# EAGLE design pi_sainsmart_relay (EAGLE 6.4)
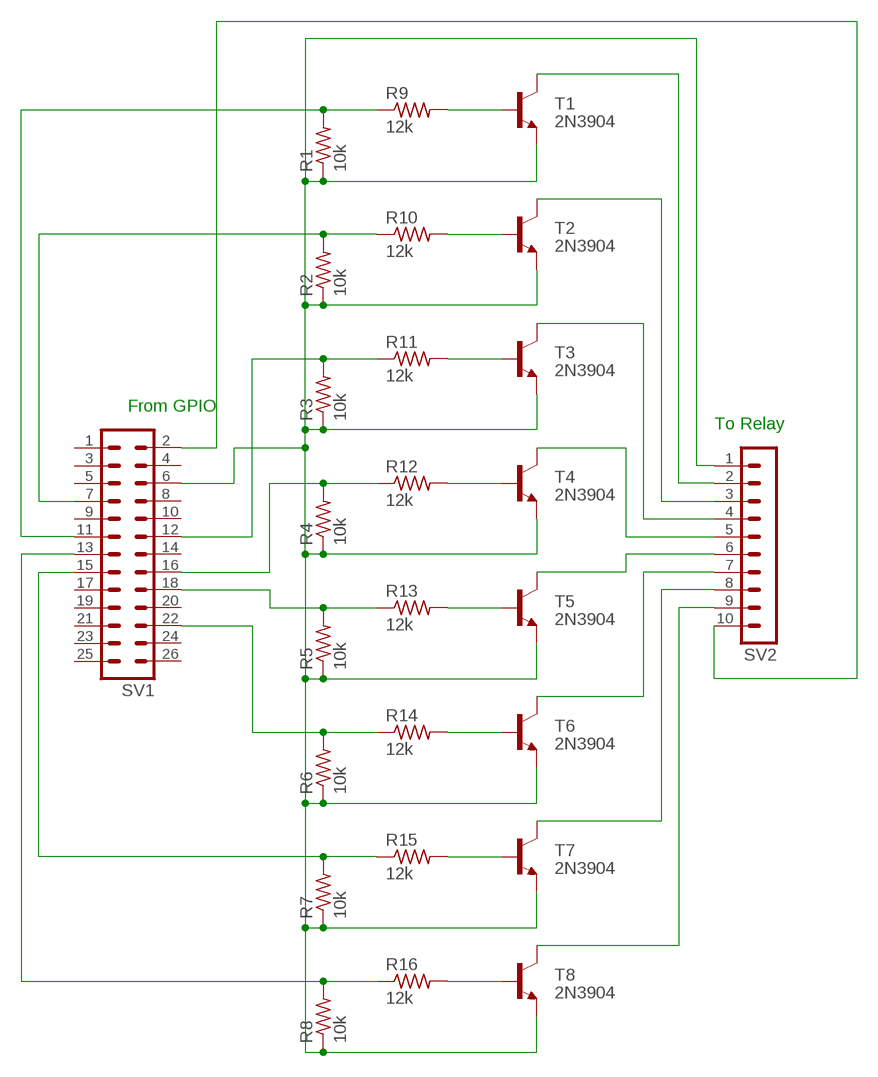
[diagram p0: schematic, sheet 1]

## Parts
R1  10k  R-US_0204/2V  [0204V]
R2  10k  R-US_0204/2V  [0204V]
R3  10k  R-US_0204/2V  [0204V]
R4  10k  R-US_0204/2V  [0204V]
R5  10k  R-US_0204/2V  [0204V]
R6  10k  R-US_0204/2V  [0204V]
R7  10k  R-US_0204/2V  [0204V]
R8  10k  R-US_0204/2V  [0204V]
R9  12k  R-US_0207/12  [0207/12]
R10  12k  R-US_0207/12  [0207/12]
R11  12k  R-US_0207/12  [0207/12]
R12  12k  R-US_0207/12  [0207/12]
R13  12k  R-US_0207/12  [0207/12]
R14  12k  R-US_0207/12  [0207/12]
R15  12k  R-US_0207/12  [0207/12]
R16  12k  R-US_0207/12  [0207/12]
SV1  MA13-2  [MA13-2]
SV2  MA10-1  [MA10-1]
T1  2N3904  -NPN-TO92-EBC  [TO92-EBC]
T2  2N3904  -NPN-TO92-EBC  [TO92-EBC]
T3  2N3904  -NPN-TO92-EBC  [TO92-EBC]
T4  2N3904  -NPN-TO92-EBC  [TO92-EBC]
T5  2N3904  -NPN-TO92-EBC  [TO92-EBC]
T6  2N3904  -NPN-TO92-EBC  [TO92-EBC]
T7  2N3904  -NPN-TO92-EBC  [TO92-EBC]
T8  2N3904  -NPN-TO92-EBC  [TO92-EBC]

## Nets
AAA: R8.2 R16.1 SV1.13
BBB: R1.2 R9.1 SV1.11
FIVEV: SV1.2 SV2.10
GND: R1.1 R2.1 R3.1 R4.1 R5.1 R6.1 R7.1 R8.1 SV1.6 SV2.1 T1.E T2.E T3.E T4.E T5.E T6.E T7.E T8.E
N$1: R16.2 T8.B
N$2: R15.2 T7.B
N$3: R14.2 T6.B
N$4: R13.2 T5.B
N$5: R12.2 T4.B
N$6: R11.2 T3.B
N$7: R10.2 T2.B
N$8: R9.2 T1.B
N$12: SV2.3 T2.C
N$13: SV2.4 T3.C
N$14: SV2.5 T4.C
N$15: SV2.6 T5.C
N$16: SV2.7 T6.C
N$17: SV2.8 T7.C
N$18: SV2.2 T1.C
N$19: SV2.9 T8.C
N$20: R3.2 R11.1 SV1.12
N$21: R4.2 R12.1 SV1.16
N$22: R5.2 R13.1 SV1.18
N$23: R6.2 R14.1 SV1.22
N$24: R2.2 R10.1 SV1.7
N$27: R7.2 R15.1 SV1.15
Unconnected: SV1.1 SV1.3 SV1.4 SV1.5 SV1.8 SV1.9 SV1.10 SV1.14 SV1.17 SV1.19 SV1.20 SV1.21 SV1.23 SV1.24 SV1.25 SV1.26

## Notes on the sheet
- From GPIO
- To Relay

## Library data of the parts
R1-R16 = resistor:R-US_: RESISTOR, American symbol
SV1 = con-lstb:MA13-2: PIN HEADER; OC_FARNELL: unknown; OC_NEWARK: unknown
SV2 = con-lstb:MA10-1: PIN HEADER; OC_FARNELL: unknown; OC_NEWARK: unknown
T1-T8 = transistor:*-NPN-: NPN Transistror BF959 corrected 2008.03.06

## Board
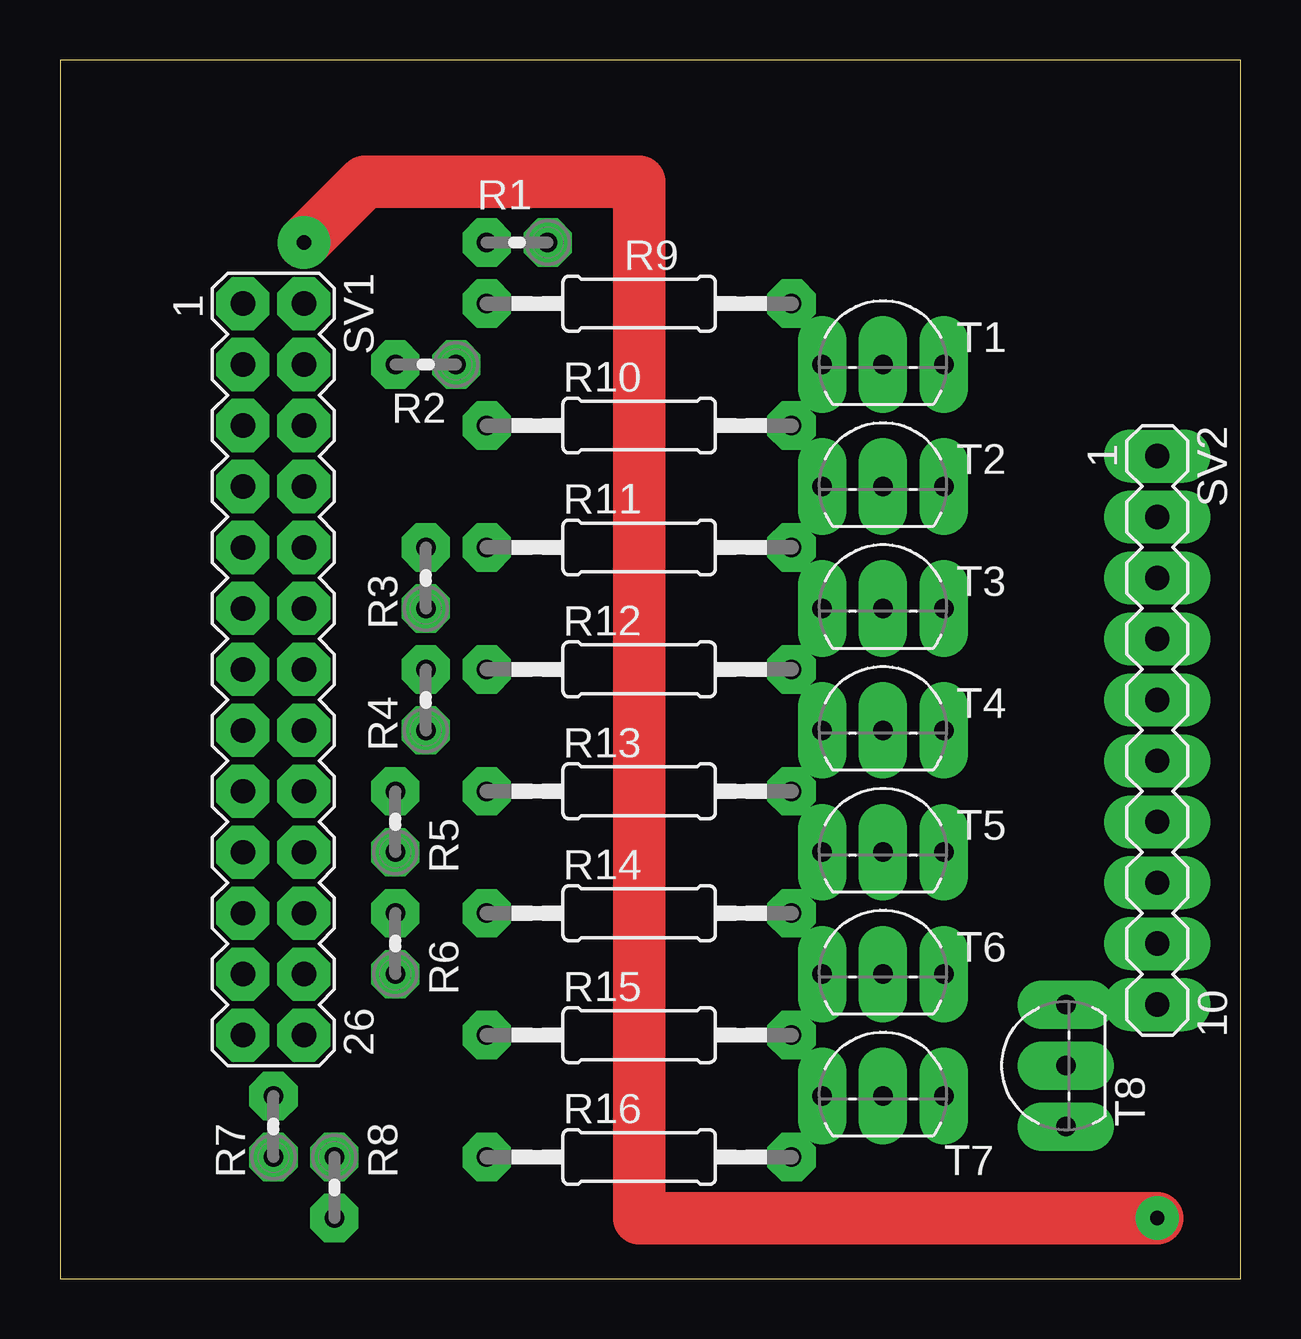
[diagram p1: board, top side]
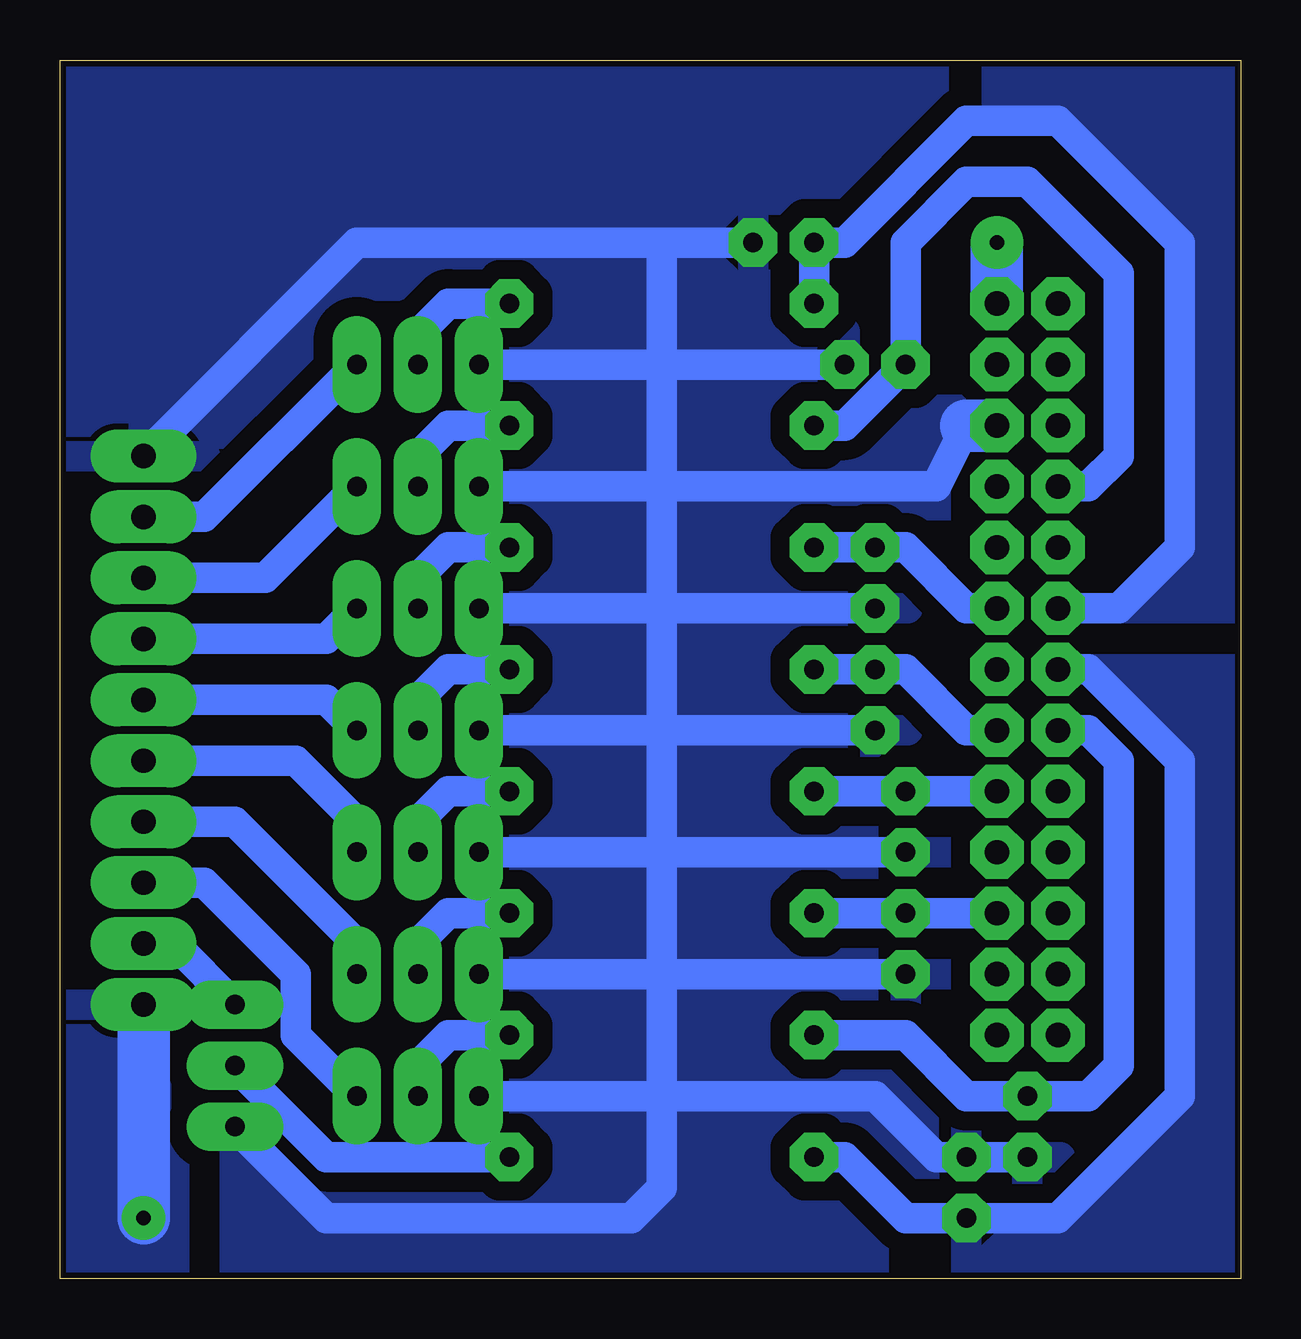
[diagram p2: board, bottom side, seen from below]

Size 49.2 x 50.79 mm. Coordinates in mm from the lower left corner, seen from the top.
Outline: 0,0 49.2,0 49.2,50.79 0,50.79 0,0
Copper layers (1*16): Top 0.035mm / dielectric 1.5mm / Bottom 0.035mm
Design rules "hobby": minimum track width 0.8mm, minimum drill 0.8mm, track to track 0.8mm, track to pad 0.8mm, pad to pad 0.45mm, via to via 0.8mm, smd to smd 8mil, copper to edge 10mil, drill to drill 8mil, minimum pad ring 0.6mm, minimum via ring 0.6mm, stop-mask expansion 0mil, vias tented up to drill 0mil, thermal gap 10mil

### Footprints (pad centres in the part's own frame; a part is rotated, then mirrored left to right if it is on the bottom)
0204V = drill 0.813 octagon: 1 -1.27,0; 2 1.27,0
0207/12 = drill 0.813 octagon: 1 -6.35,0; 2 6.35,0
MA13-2 = drill 1.016 octagon: 1 -15.24,-1.27; 2 -15.24,1.27; 3 -12.7,-1.27; 4 -12.7,1.27; 5 -10.16,-1.27; 6 -10.16,1.27; 7 -7.62,-1.27; 8 -7.62,1.27; 9 -5.08,-1.27; 10 -5.08,1.27; 11 -2.54,-1.27; 12 -2.54,1.27; 13 0,-1.27; 14 0,1.27; 15 2.54,-1.27; 16 2.54,1.27; 17 5.08,-1.27; 18 5.08,1.27; 19 7.62,-1.27; 20 7.62,1.27; 21 10.16,-1.27; 22 10.16,1.27; 23 12.7,-1.27; 24 12.7,1.27; 25 15.24,-1.27; 26 15.24,1.27
MA10-1 = drill 1.016 long: 1 -11.43,0; 2 -8.89,0; 3 -6.35,0; 4 -3.81,0; 5 -1.27,0; 6 1.27,0; 7 3.81,0; 8 6.35,0; 9 8.89,0; 10 11.43,0
TO92-EBC = drill 0.813 long: B 0,-1.27; C 2.54,-1.27; E -2.54,-1.27

### Placement (x,y rotation side)
R1  19.05,43.18 180 top
R2  15.24,38.1 180 top
R3  15.24,29.21 90 top
R4  15.24,24.13 90 top
R5  13.97,19.05 90 top
R6  13.97,13.97 90 top
R7  8.89,6.35 90 top
R8  11.43,3.81 270 top
R9  24.13,40.64 0 top
R10  24.13,35.56 0 top
R11  24.13,30.48 0 top
R12  24.13,25.4 0 top
R13  24.13,20.32 0 top
R14  24.13,15.24 0 top
R15  24.13,10.16 0 top
R16  24.13,5.08 0 top
SV1  8.89,25.4 270 top
SV2  45.72,22.86 270 top
T1  34.29,39.37 0 top
T2  34.29,34.29 0 top
T3  34.29,29.21 0 top
T4  34.29,24.13 0 top
T5  34.29,19.05 0 top
T6  34.29,13.97 0 top
T7  34.29,8.89 0 top
T8  40.64,8.89 90 top

### Tracks (layer width: path | path; a pad name or v marks a point on that pad's centre or on a via)
AAA
  Bottom 1.27: R16.1 16.51,5.08 13.97,2.54 R8.2 7.62,2.54 2.54,7.62 2.54,21.59 6.35,25.4 SV1.13
  pour Bottom: 6.35,25.4 2.54,21.59 2.54,7.62 7.62,2.54 11.43,2.54 11.43,0 0,0 0,25.4
BBB
  Bottom 1.27: SV1.11 5.08,27.94 2.54,30.48 2.54,43.18 7.62,48.26 11.43,48.26 16.51,43.18 R1.2 R9.1
  pour Bottom: 10.16,50.8 10.16,48.26 7.62,48.26 2.54,43.18 2.54,30.48 5.08,27.94 0,27.94 0,50.8
FIVEV  (via drill 0.6, 0.6 pad 2.18)
  Top 2.184: v45.72,2.54 24.13,2.54 24.13,45.72 12.7,45.72 v10.16,43.18
  Bottom 2.184: SV1.2 v10.16,43.18 | SV2.10 v45.72,2.54
  pour Bottom: 49.53,11.43 45.72,11.43 44.45,10.16 44.45,0 49.53,0
GND
  Bottom 1.27: 24.13,7.62 24.13,12.7 | 24.13,12.7 24.13,17.78 | 24.13,17.78 24.13,22.86 | 24.13,22.86 24.13,27.94 | 24.13,27.94 24.13,33.02 | 24.13,33.02 24.13,38.1 | 24.13,38.1 T1.E | T4.E 24.13,22.86 | T6.E 24.13,12.7 | R4.1 24.13,22.86 | R3.1 24.13,27.94 | 11.43,35.56 12.7,33.02 24.13,33.02 | R5.1 24.13,17.78 | R6.1 24.13,12.7 | T2.E 24.13,33.02 | 24.13,7.62 24.13,3.81 25.4,2.54 38.1,2.54 T8.E | SV2.1 36.83,43.18 24.13,43.18 | 24.13,43.18 24.13,38.1 | R1.1 24.13,43.18 | R2.1 24.13,38.1 | T5.E 24.13,17.78 | T3.E 24.13,27.94 | T7.E 24.13,7.62 | R7.1 R8.1 12.7,5.08 15.24,7.62 24.13,7.62
  Bottom 2.184: SV1.6 11.43,35.56
  pour Bottom: 0,50.8 49.53,50.8 49.53,13.97 44.45,13.97 41.91,11.43 41.91,0 0,0
N$1
  Bottom 1.27: R16.2 38.1,5.08 T8.B
N$2
  Bottom 1.27: R15.2 33.02,10.16 34.29,8.89 T7.B
N$3
  Bottom 1.27: T6.B 34.29,13.97 33.02,15.24 R14.2
N$4
  Bottom 1.27: T5.B 34.29,19.05 33.02,20.32 R13.2
N$5
  Bottom 1.27: T4.B 34.29,24.13 33.02,25.4 R12.2
N$6
  Bottom 1.27: T3.B 34.29,29.21 33.02,30.48 R11.2
N$7
  Bottom 1.27: T2.B 34.29,34.29 33.02,35.56 R10.2
N$8
  Bottom 1.27: T1.B 34.29,39.37 33.02,40.64 R9.2
N$12
  Bottom 1.27: SV2.3 40.64,29.21 T2.C
N$13
  Bottom 1.27: T3.C 38.1,26.67 SV2.4
N$14
  Bottom 1.27: SV2.5 38.1,24.13 T4.C
N$15
  Bottom 1.27: T5.C 36.83,19.05 39.37,21.59 SV2.6
N$16
  Bottom 1.27: SV2.7 41.91,19.05 36.83,13.97 T6.C
N$17
  Bottom 1.27: T7.C 39.37,10.16 39.37,12.7 43.18,16.51 SV2.8
N$18
  Bottom 1.27: T1.C 43.18,31.75 SV2.2
N$19
  Bottom 1.27: SV2.9 44.45,13.97 T8.C
N$20
  Bottom 1.27: R11.1 R3.2 13.97,30.48 11.43,27.94 SV1.12
N$21
  Bottom 1.27: R12.1 R4.2 13.97,25.4 11.43,22.86 SV1.16
N$22
  Bottom 1.27: SV1.18 R5.2 R13.1
N$23
  Bottom 1.27: R14.1 R6.2 SV1.22
N$24
  Bottom 1.27: R10.1 16.51,35.56 R2.2 13.97,43.18 11.43,45.72 8.89,45.72 5.08,41.91 5.08,34.29 6.35,33.02 SV1.7
N$27
  Bottom 1.27: SV1.15 6.35,22.86 5.08,21.59 5.08,8.89 6.35,7.62 R7.2 11.43,7.62 13.97,10.16 R15.1